# Altium schematic sheet 10) Button and I_O Conn.SchDoc
size 447 x 332 mm
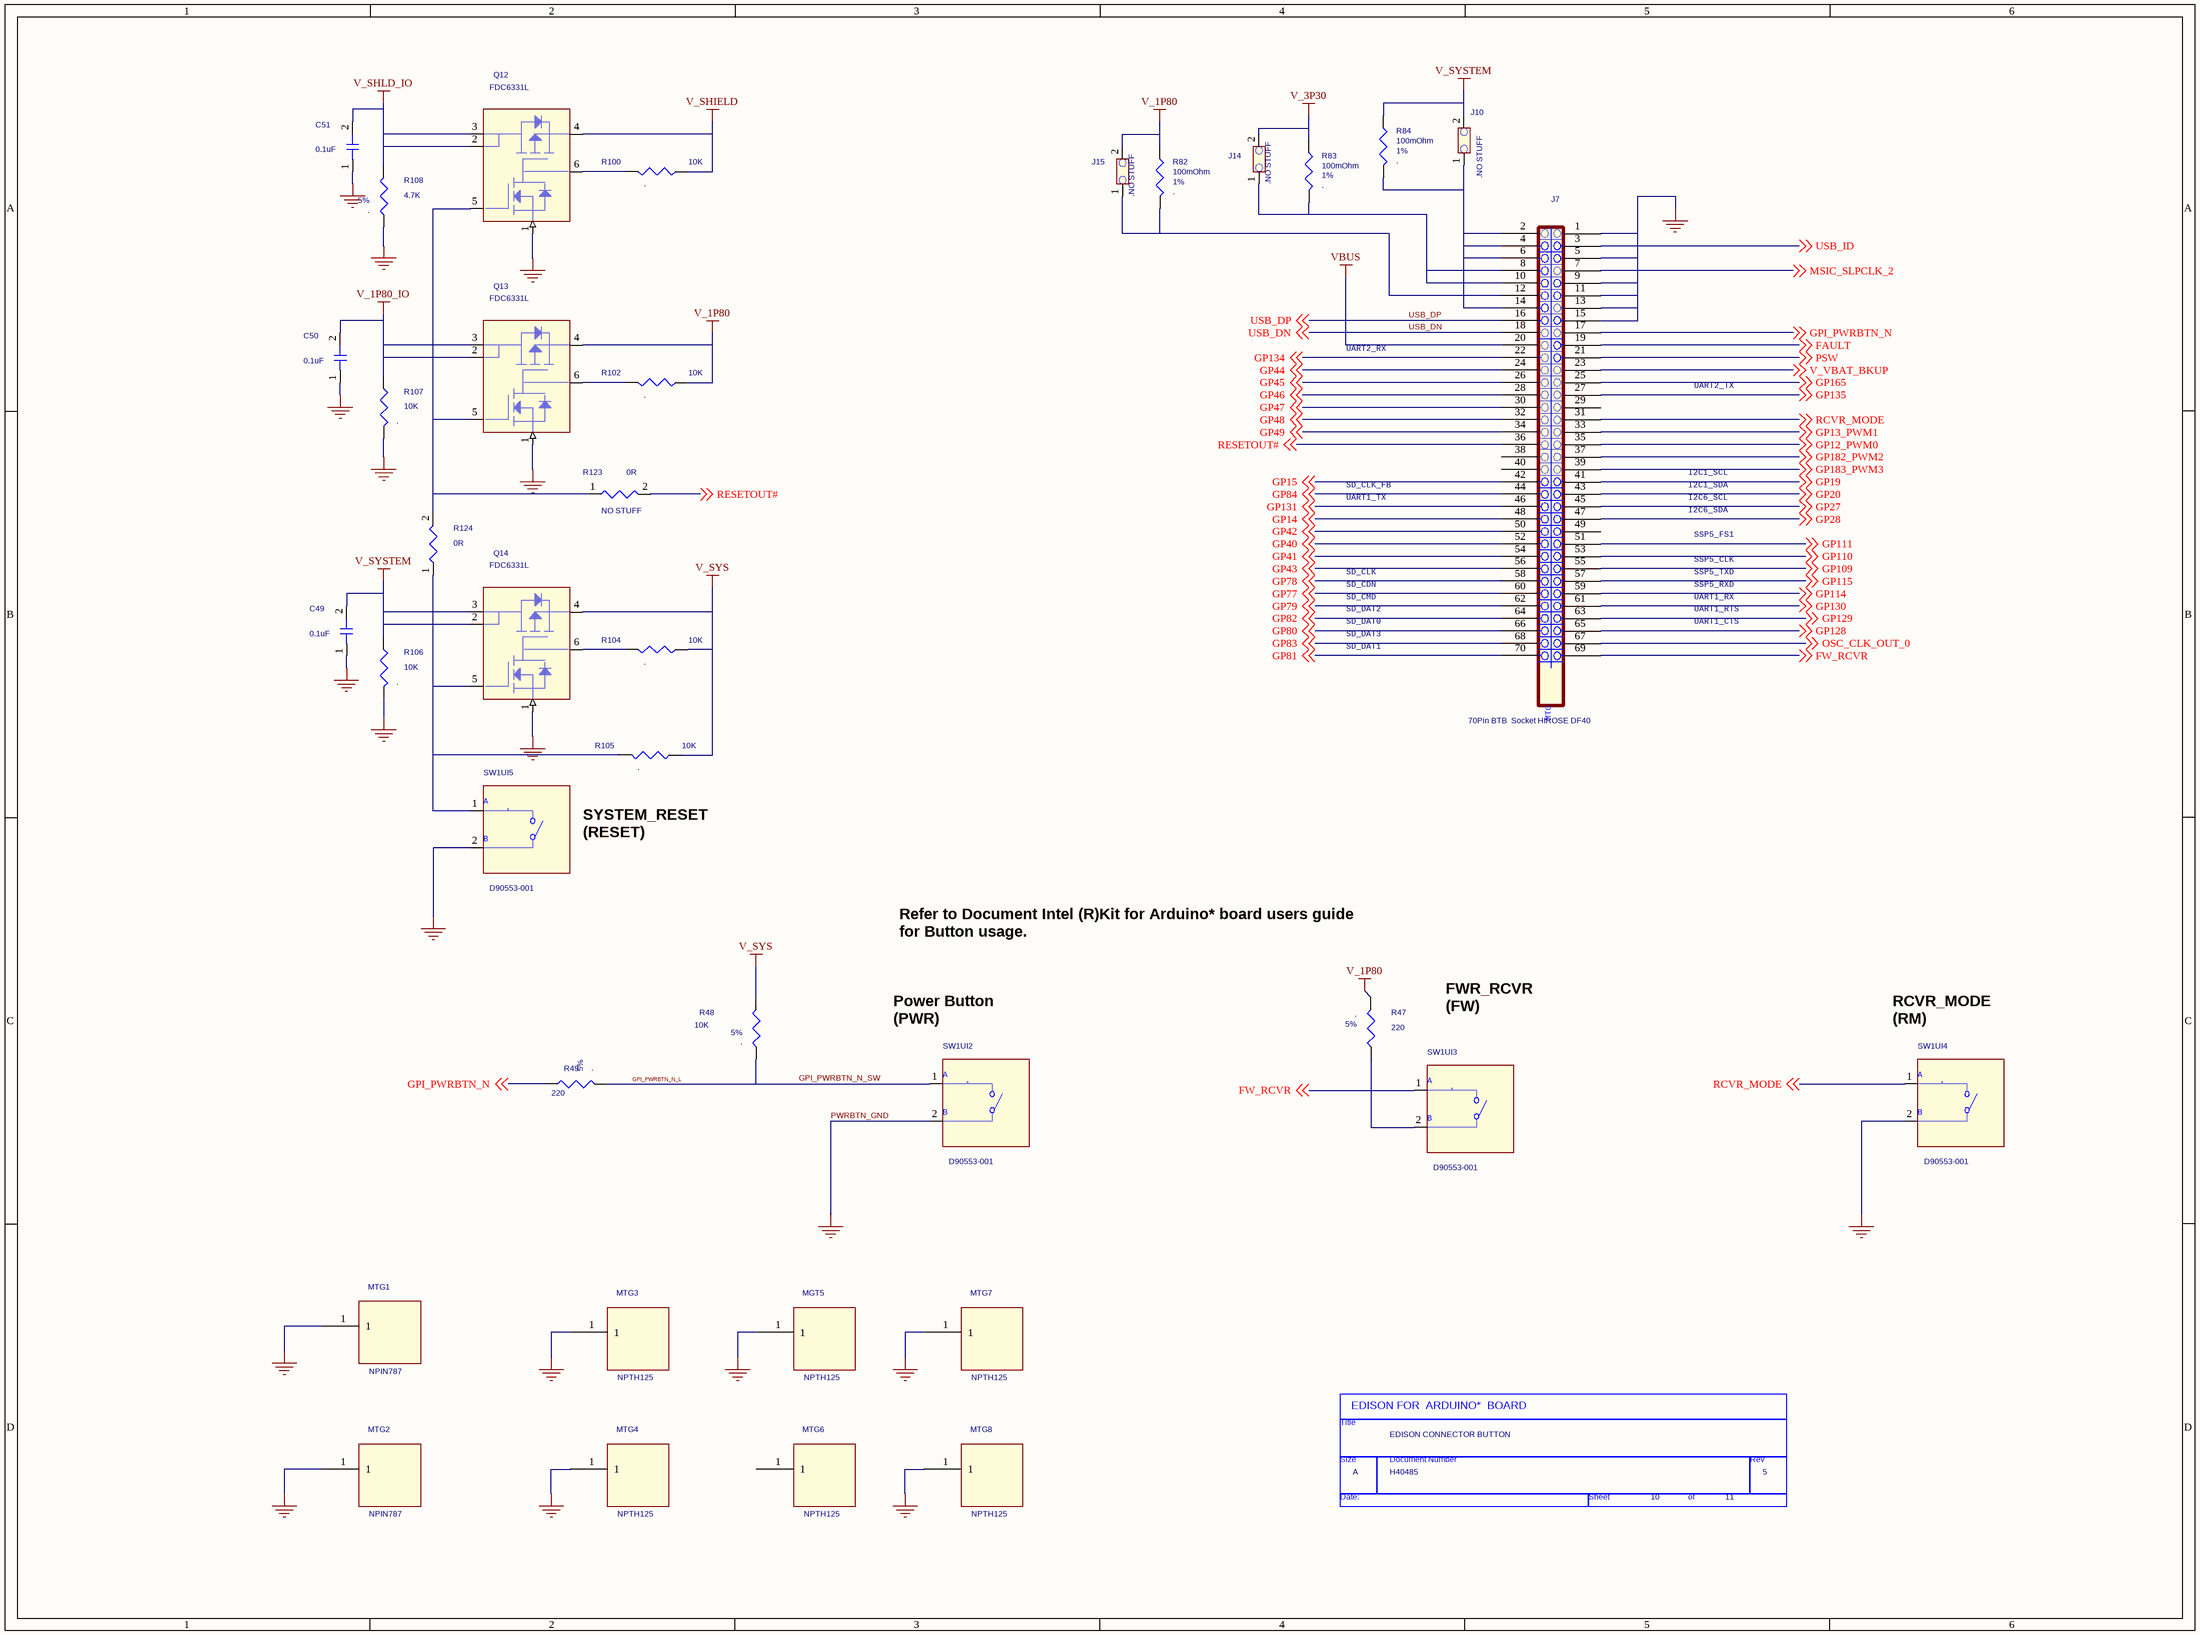
[diagram p0: 10) Button and I_O Conn.SchDoc]

## Parts
*  Page Count: 11  Page Number: 10  Page Size: A  Title: EDISON CONNECTOR BUTTON  RevCode: 5  Doc: H40485  (hidden comment: TitleBlock0)  (graphical)
C49  0.1uF  [C0201]
C50  0.1uF  [C0201]
C51  0.1uF  [C0201]
J7  70Pin BTB  Socket HIROSE DF40  [2x35_p4mm_btb_axt_skt]
J10  NO_STUFF: .NO STUFF  [102276-001]  (hidden comment: CON2_HDR)
J14  NO_STUFF: .NO STUFF  [102276-001]  (hidden comment: CON2_HDR)
J15  NO_STUFF: .NO STUFF  [102276-001]  (hidden comment: CON2_HDR)
MGT5  NPTH125  [SYMBOL_NPTH125]
MTG1  NPIN787  [NPIN787]
MTG2  NPIN787  [NPIN787]
MTG3  NPTH125  [SYMBOL_NPTH125]
MTG4  NPTH125  [SYMBOL_NPTH125]
MTG6  NPTH125  [SYMBOL_NPTH125]
MTG7  NPTH125  [SYMBOL_NPTH125]
MTG8  NPTH125  [SYMBOL_NPTH125]
Q12  FDC6331L  [SSOT-6]
Q13  FDC6331L  [SSOT-6]
Q14  FDC6331L  [SSOT-6]
R47  220  NO_STUFF: .  TOL: 5%  [SMR0201]
R48  10K  NO_STUFF: .  TOL: 5%  [SMR0201]
R49  220  NO_STUFF: .  TOL: 5%  [SMR0201]
R82  100mOhm  TOL: 1%  NO_STUFF: .  [SMR0402]
R83  100mOhm  TOL: 1%  NO_STUFF: .  [SMR0402]
R84  100mOhm  TOL: 1%  NO_STUFF: .  [SMR0402]
R100  10K  NO_STUFF: .  [SMR0201]
R102  10K  NO_STUFF: .  [SMR0201]
R104  10K  NO_STUFF: .  [SMR0201]
R105  10K  NO_STUFF: .  [SMR0201]
R106  10K  NO_STUFF: .  [SMR0201]
R107  10K  NO_STUFF: .  [SMR0201]
R108  4.7K  NO_STUFF: .  TOL: 5%  [SMR0201]
R123  0R  [0603.PRT]
R124  0R  [0603.PRT]
SW1UI2  PART_NUMBER: D90553-001  [sw_evqp7_4p]  (hidden comment: LIGHT TOUCH SWITCH EVQP7J01P)
SW1UI3  PART_NUMBER: D90553-001  [sw_evqp7_4p]  (hidden comment: LIGHT TOUCH SWITCH EVQP7J01P)
SW1UI4  PART_NUMBER: D90553-001  [sw_evqp7_4p]  (hidden comment: LIGHT TOUCH SWITCH EVQP7J01P)
SW1UI5  PART_NUMBER: D90553-001  [sw_evqp7_4p]  (hidden comment: LIGHT TOUCH SWITCH EVQP7J01P)

## Nets
PWRBTN_GND: C49.1(END1) C50.1(END1) C51.1(END1) J7.1 J7.5 J7.9 J7.11 J7.13 J7.15 MGT5.1 MTG1.1 MTG2.1 MTG3.1 MTG4.1 MTG7.1 MTG8.1 Q12.1(R2) Q13.1(R2) Q14.1(R2) R106.2 R107.2 R108.2 SW1UI2.2(B) SW1UI4.2(B) SW1UI5.2(B)  [also labelled GND]
V_1P80: J15.2 Q13.4(VOUT) R47.2 R82.1 R102.1
V_1P80_IO: C50.2(END2) Q13.2(VOUT2) Q13.3(VOUT1) R107.1
V_3P30: J14.2 R83.1
V_SHIELD: Q12.4(VOUT) R100.1
V_SHLD_IO: C51.2(END2) Q12.2(VOUT2) Q12.3(VOUT1) R108.1
V_SYS: Q14.4(VOUT) R48.1 R104.1 R105.1
V_SYSTEM: C49.2(END2) J10.2 Q14.2(VOUT2) Q14.3(VOUT1) R84.1 R106.1
VBUS: J7.20
FAULT: J7.19 ; off-sheet FAULT
FW_RCVR: J7.69 SW1UI3.1(A) ; off-sheet FW_RCVR
GP12_PWM0: J7.35 ; off-sheet GP12_PWM0
GP13_PWM1: J7.33 ; off-sheet GP13_PWM1
GP14: J7.48 ; off-sheet GP14
GP15: J7.42 ; off-sheet GP15
GP19: J7.41 ; off-sheet GP19
GP20: J7.43 ; off-sheet GP20
GP27: J7.45 ; off-sheet GP27
GP28: J7.47 ; off-sheet GP28
GP40: J7.52 ; off-sheet GP40
GP41: J7.54 ; off-sheet GP41
GP42: J7.50 ; off-sheet GP42
GP43: J7.56 ; off-sheet GP43
GP44: J7.24 ; off-sheet GP44
GP45: J7.26 ; off-sheet GP45
GP46: J7.28 ; off-sheet GP46
GP47: J7.30 ; off-sheet GP47
GP48: J7.32 ; off-sheet GP48
GP49: J7.34 ; off-sheet GP49
GP77: J7.60 ; off-sheet GP77
GP78: J7.58 ; off-sheet GP78
GP79: J7.62 ; off-sheet GP79
GP80: J7.66 ; off-sheet GP80
GP81: J7.70 ; off-sheet GP81
GP82: J7.64 ; off-sheet GP82
GP83: J7.68 ; off-sheet GP83
GP84: J7.44 ; off-sheet GP84
GP109: J7.55 ; off-sheet GP109
GP110: J7.53 ; off-sheet GP110
GP111: J7.51 ; off-sheet GP111
GP114: J7.59 ; off-sheet GP114
GP115: J7.57 ; off-sheet GP115
GP128: J7.65 ; off-sheet GP128
GP129: J7.63 ; off-sheet GP129
GP130: J7.61 ; off-sheet GP130
GP131: J7.46 ; off-sheet GP131
GP134: J7.22 ; off-sheet GP134
GP135: J7.27 ; off-sheet GP135
GP165: J7.25 ; off-sheet GP165
GP182_PWM2: J7.37 ; off-sheet GP182_PWM2
GP183_PWM3: J7.39 ; off-sheet GP183_PWM3
GPI_PWRBTN_N: J7.17 R49.1 ; off-sheet GPI_PWRBTN_N
GPI_PWRBTN_N_L: R48.2 R49.2 SW1UI2.1(A)  [also labelled GPI_PWRBTN_N_SW]
MSIC_SLPCLK_2: J7.7 ; off-sheet MSIC_SLPCLK_2
OSC_CLK_OUT_0: J7.67 ; off-sheet OSC_CLK_OUT_0
PSW: J7.21 ; off-sheet PSW
RCVR_MODE: J7.31 SW1UI4.1(A) ; off-sheet RCVR_MODE
RESETOUT#: J7.36 R123.2 ; off-sheet RESETOUT#
USB_DN: J7.18 ; off-sheet USB_DN
USB_DP: J7.16 ; off-sheet USB_DP
USB_ID: J7.3 ; off-sheet USB_ID
V_VBAT_BKUP: J7.23 ; off-sheet V_VBAT_BKUP
NetJ7_2: J7.2 J7.4 J7.6 J7.14 J10.1 R84.2
NetJ7_8: J7.8 J7.10 J14.1 R83.2
NetJ7_12: J7.12 J15.1 R82.2
NetQ12_5: Q12.5(ON) Q13.5(ON) R123.1 R124.2
NetQ12_6: Q12.6(R1C1) R100.2
NetQ13_6: Q13.6(R1C1) R102.2
NetQ14_5: Q14.5(ON) R105.2 R124.1 SW1UI5.1(A)
NetQ14_6: Q14.6(R1C1) R104.2
NetR47_1: R47.1 SW1UI3.2(B)

Not connected (* = marked no-connect by the designer): J7 29 38 40 49; MTG6 1

## Notes on the sheet
- UART2_RX
- UART2_TX
- I2C1_SCL
- UART1_TX
- SD_CLK_FB
- I2C1_SDA
- I2C6_SCL
- I2C6_SDA
- SSP5_FS1
- SD_CLK
- SD_CDN
- SD_CMD
- SSP5_CLK
- SSP5_TXD
- SSP5_RXD
- UART1_RX
- SD_DAT2
- SD_DAT0
- SD_DAT3
- SD_DAT1
- UART1_RTS
- UART1_CTS
- SYSTEM_RESET
  (RESET)
- Refer to Document Intel (R)Kit for Arduino* board users guide
  for Button usage.
- (near SW1UI2) Power Button
  (PWR)
- FWR_RCVR
  (FW)
- (near SW1UI4) RCVR_MODE
  (RM)
- (in symbol CON70,SKT,SM,4mm,AXT570124_0) MTG
- (in symbol TitleBlock0) EDISON FOR  ARDUINO*  BOARD; Title; Size; Document Number; Rev; Date:; Sheet; of

## Library data of the parts
C49-C51 = CAP: CAPC,X5R,0201,0.1UF,10.00V,+/- 10%; PART_NUMBER: C83410-014; Manufacturer: GENERIC; OriginalSymbolOrigin: (-50,50); Process: SMD; Code: 27; VOLTAGE: ?; PERC: ?; PATH: ?
J7 = CON70,SKT,SM,4mm,AXT570124_0: CONN,MISC,70P,BTB SKT,.4MM SMT; PART_NUMBER: H42241-001; ROOM: NO_ROOM; NO_STUFF: .; FINANCE: x; LEAD_FREE: YES; MFG: HIROSE; BOM: x; IPN: H42241-001; DEVICE: H42241-001
J10 J14 J15 = CON2,HDR,TH,0.1in,A91829-020: CONN,HDR,1 X 2,PLG,VT,0.1,093ST,KP; PART_NUMBER: E81838-001; LEAD_FREE: YES; Device: E81838-001; IPN: E81838-001; BOM: x; FINANCE: x
MGT5 MTG3 MTG4 MTG6-MTG8 = symbol_npth125_0
MTG1 MTG2 = MOUNTING HOLE 787
Q12-Q14 = IC,FDC6331,LOADSWI: C,FDC6331L,LOAD_SWITCH,2.8A; PART_NUMBER: G79283-001; NO_STUFF: .; LEAD_FREE: YES; BOM: x; IPN: G79283-001; Device: fdc6331; FINANCE: x; PART NUMBER: G79283-001
R47 R49 = RESD,0201,5%,1/20W,220: RES_D,0201,220.00OHM,5.00%,1/20W,; Device: C80792-046; LEAD_FREE: YES; BOM: x; ROOM: UI_BUTTONS; RATING: 1/20W; IPN: C80792-046; PART_NUMBER: C80792-046; FINANCE: x
R48 = RESD,0201,5%,1/20W,10K: RES D,0201,10.00 kOHM,5.00%,1/20W,YES; Device: C80792-002; BOM: x; ROOM: USB; RATING: 1/20W; IPN: C80792-002; PART_NUMBER: C80792-002; LEAD_FREE: YES; FINANCE: x
R82-R84 = RESD,0402,1%,1/16W,100mOhm: RES D,0402,0.10 OHM,1.00%,,1/16W; PART_NUMBER: C65288-008; LEAD_FREE: YES; BOM: x; IPN: C65288-008; RATING: 1/16W; Device: C65288-008; FINANCE: x
R100 R102 R104-R107 = RESD,0201,5%,1/20W,10K: RES D,0201,10.00 kOHM,5.00%,1/20W,YES; Device: C80792-002; TOL: 5%; BOM: x; ROOM: AUDIO_CODEC; RATING: 1/20W; IPN: C80792-002; PART_NUMBER: C80792-002; LEAD_FREE: YES; FINANCE: x
R108 = RESD,0201,5%,1/20W,4.7K: RES D,0201,4.70 kOHM,5.00%,1/20W,YES; Device: C80792-014; BOM: x; ROOM: APE_PMIC_MISC; RATING: 1/20W; IPN: C80792-014; PART_NUMBER: C80792-014; LEAD_FREE: YES; FINANCE: x
R123 R124 = R_0: RES_D,0201,0.00OHM,1/20W; Manufacturer: Yageo; PART_NUMBER: C80792-009
  R123: NO STUFF: NO STUFF
SW1UI2-SW1UI5 = SWITCH,EVQP7J01P,4P,PWR_0: CONN,SWIT,TACTILE,VT,SPST,2,50.0 mA,SMT>; MFG: Panasonic; BOM: x; ROOM: UI_BUTTONS; NO_STUFF: .; LEAD_FREE: YES; MFG P/N: EVQP7J01P; IPN: D90553-001; FINANCE: x; DEVICE: D90553-001
* = TitleBlock0: Page Create Date: March  8, 1995